# EAGLE schematic 1-Axis_Board_-_Camera_Gantry (EAGLE 6.4)
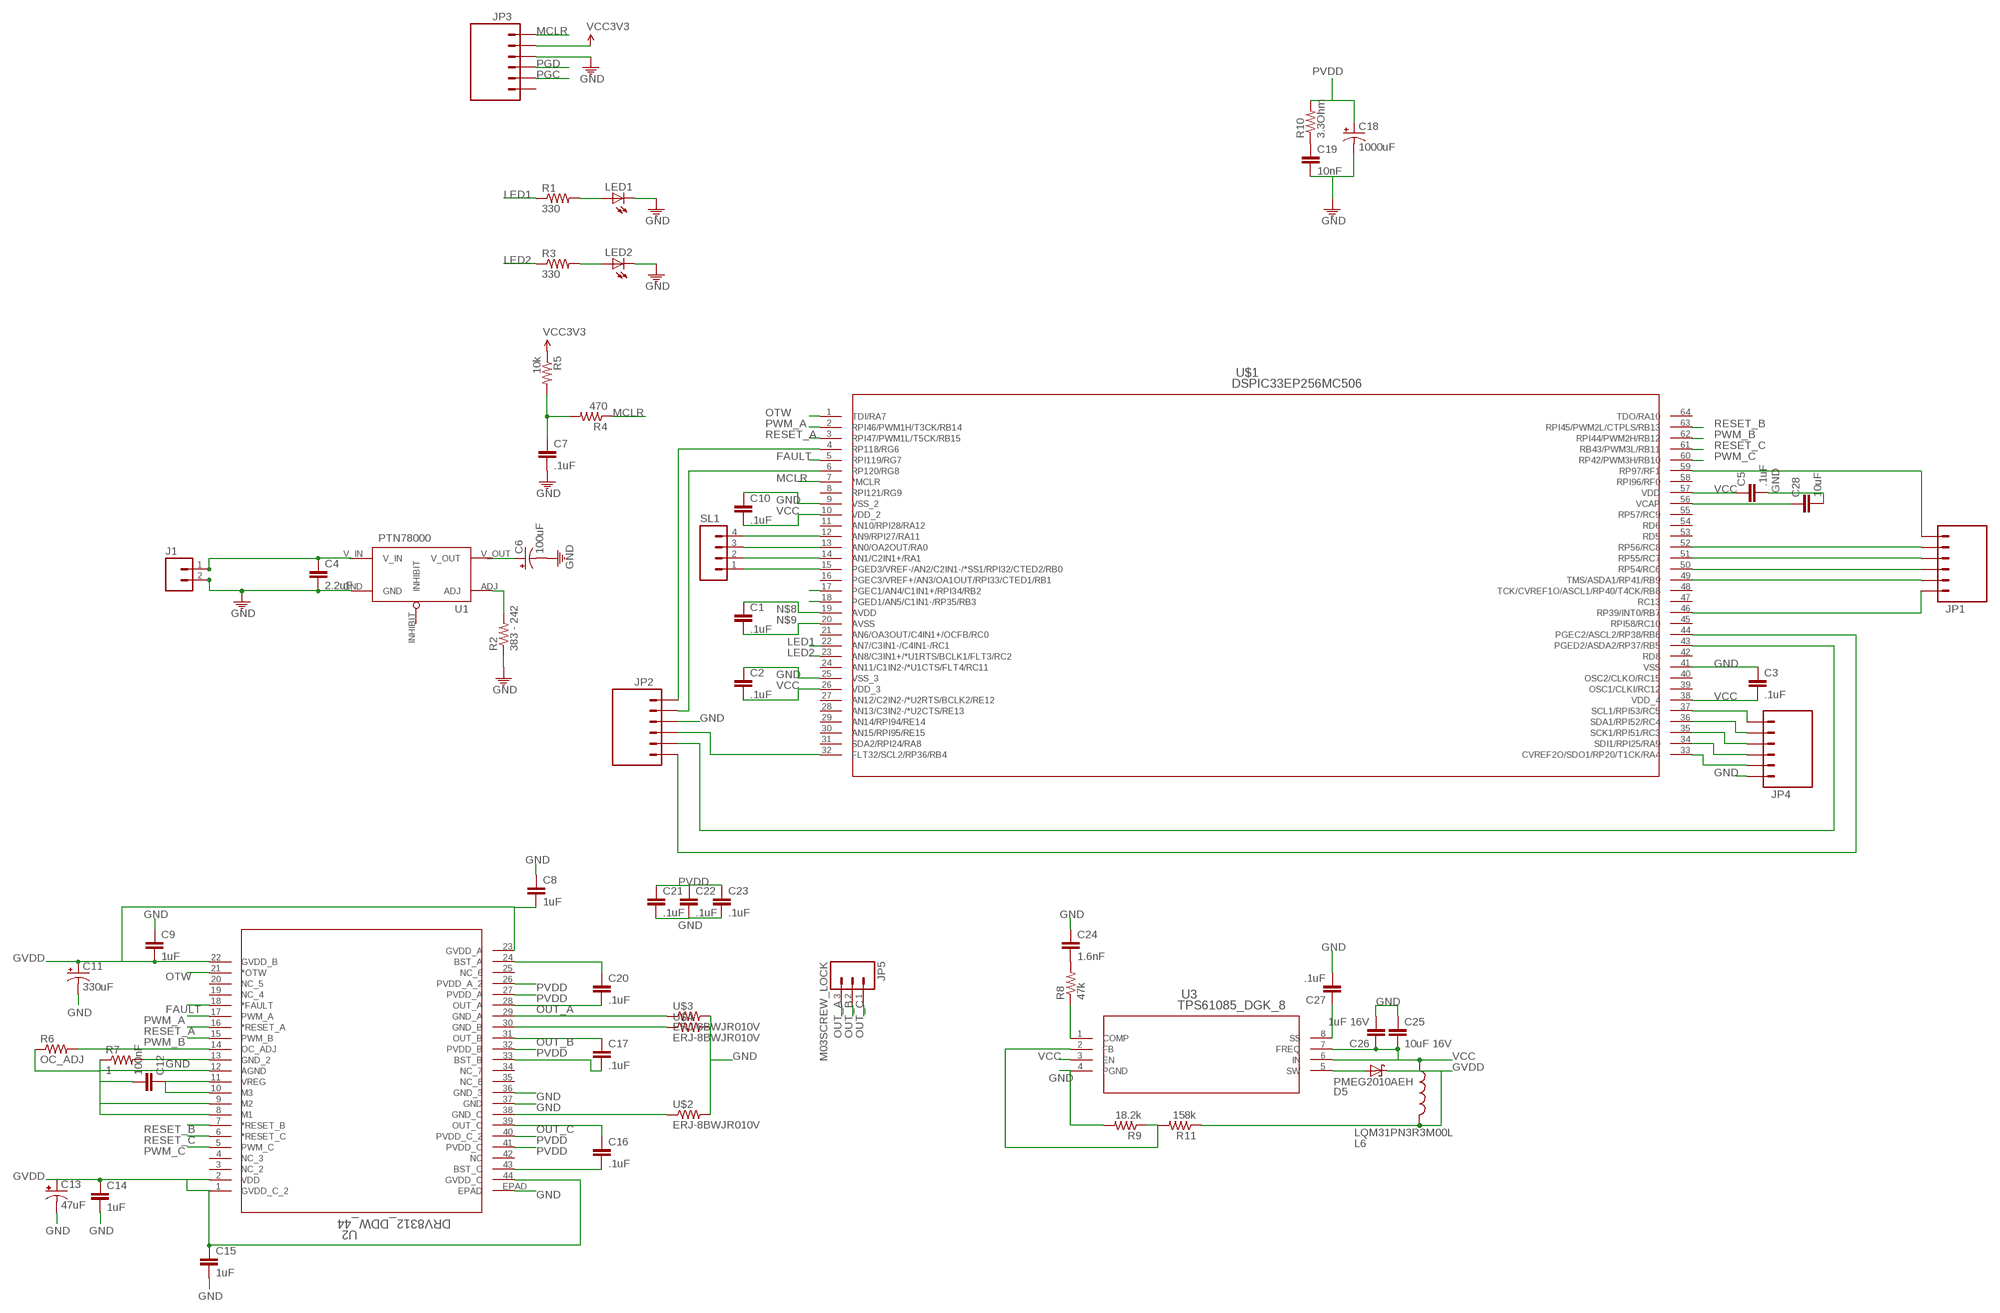
[diagram p0: schematic, sheet 1]

## Parts
C1  .1uF  CAP0805  [0805]
C2  .1uF  CAP0805  [0805]
C3  .1uF  CAP0805  [0805]
C4  2.2uF  CAP1206  [1206]
C5  .1uF  CAP0805  [0805]
C6  100uF  CAP_POLPTH1  [CPOL-RADIAL-100UF-25V]
C7  .1uF  CAP0805  [0805]
C8  1uF  CAP0805  [0805]
C9  1uF  CAP0805  [0805]
C10  .1uF  CAP0805  [0805]
C11  330uF  CAP_POLPTH4  [CPOL-RADIAL-1000UF-25V]
C12  100nF  CAP0805  [0805]
C13  47uF  CAP_POLPTH4  [CPOL-RADIAL-1000UF-25V]
C14  1uF  CAP0805  [0805]
C15  1uF  CAP0805  [0805]
C16  .1uF  CAP0805  [0805]
C17  .1uF  CAP0805  [0805]
C18  1000uF  CAP_POLPTH4  [CPOL-RADIAL-1000UF-25V]
C19  10nF  CAP0805  [0805]
C20  .1uF  CAP0805  [0805]
C21  .1uF  CAP0805  [0805]
C22  .1uF  CAP0805  [0805]
C23  .1uF  CAP0805  [0805]
C24  1.6nF  CAP0805  [0805]
C25  10uF 16V  CAP1206  [1206]
C26  1uF 16V  CAP0805  [0805]
C27  .1uF  CAP0805  [0805]
C28  10uF  CAP1206  [1206]
D5  PMEG2010AEH  [SOD-123]
J1  M023.5MM-NO_SILK  [SCREWTERMINAL-3.5MM-2-NS]
JP1  M06LOCK  [1X06_LOCK]
JP2  M06LOCK  [1X06_LOCK]
JP3  M06LOCK  [1X06_LOCK]
JP4  M06LOCK  [1X06_LOCK]
JP5  M03SCREW_LOCK  [SCREWTERMINAL-3.5MM-3_LOCK.007S]
L6  LQM31PN3R3M00L  [1206]
LED1  LED1206  [LED-1206]
LED2  LED1206  [LED-1206]
R1  330  RESISTOR0805-RES  [0805]
R2  383 - 242  RESISTOR0805-RES  [0805]
R3  330  RESISTOR0805-RES  [0805]
R4  470  RESISTOR0805-RES  [0805]
R5  10k  RESISTOR0805-RES  [0805]
R6  OC_ADJ  RESISTOR0805-RES  [0805]
R7  1  RESISTOR0805-RES  [0805]
R8  47k  RESISTOR0805-RES  [0805]
R9  18.2k  RESISTOR0805-RES  [0805]
R10  3.3Ohm  RESISTOR0805-RES  [0805]
R11  158k  RESISTOR0805-RES  [0805]
SL1  M04LOCK  [1X04_LOCK]
U1  PTN78000  PTN78000THROUGH-HOLE  [PTN78000]
U2  DRV8312_DDW_44  [DDW44_8P26X4P31]
U3  TPS61085_DGK_8  [DGK8]
U$1  DSPIC33EP256MC506  [QFP64-10X10MC]
U$2  ERJ-8BWJR010V  [1206]
U$3  ERJ-8BWJR010V  [1206]
U$4  ERJ-8BWJR010V  [1206]

## Nets
FAULT: U2.18(*FAULT) U$1.5(RPI119/RG7)
GND: C2.1 C3.1 C4.2 C5.2 C6.2(-) C7.2 C8.1 C9.1 C10.1 C11.2(-) C13.2(-) C14.2 C15.2 C18.2(-) C19.2 C21.2 C22.2 C23.2 C24.1 C25.1 C26.2 C27.2 C28.2 J1.2 JP2.3 JP3.3 JP4.1 LED1.C LED2.C R2.1 R7.2 R9.2 U1.GND U2.13(GND_2) U2.36(GND_3) U2.37(GND) U2.EPAD U3.4(PGND) U$1.9(VSS_2) U$1.25(VSS_3) U$1.41(VSS) U$2.2 U$3.2 U$4.2
GVDD: C8.2 C9.2 C11.1(+) C13.1(+) C14.1 C15.1 D5.C L6.2 R11.1 U2.1(GVDD_C_2) U2.2(VDD) U2.22(GVDD_B) U2.23(GVDD_A) U2.44(GVDD_C)
LED1: R1.1 U$1.22(AN7/C3IN1-/C4IN1-/RC1)
LED2: R3.1 U$1.23(AN8/C3IN1+/*U1RTS/BCLK1/FLT3/RC2)
MCLR: JP3.1 R4.1 U$1.7(*MCLR)
N$1: LED1.A R1.2
N$2: C7.1 R4.2 R5.2
N$3: LED2.A R3.2
N$4: U2.38(GND_C) U$2.1
N$5: U2.29(GND_A) U$3.1
N$6 [power]: R2.2 U1.ADJ
N$7: U2.30(GND_B) U$4.1
N$8: C1.1 U$1.19(AVDD)
N$9: C1.2 U$1.20(AVSS)
N$10: C27.1 U3.8(SS)
N$11: R8.1 U3.1(COMP)
N$12: C24.2 R8.2
N$13: C19.1 R10.1
N$14: C28.1 U$1.56(VCAP)
N$15: D5.A U3.5(SW)
N$16: R9.1 R11.2 U3.2(FB)
N$17: JP2.1 U$1.4(RP118/RG6)
N$19: JP2.4 U$1.32(FLT32/SCL2/RP36/RB4)
N$20: JP2.5 U$1.43(PGED2/ASDA2/RP37/RB5)
N$21: C16.2 U2.43(BST_C)
N$22: JP2.6 U$1.44(PGEC2/ASCL2/RP38/RB6)
N$23: JP1.1 U$1.46(RP39/INT0/RB7)
N$24: JP1.2 U$1.49(TMS/ASDA1/RP41/RB9)
N$25: JP1.3 U$1.50(RP54/RC6)
N$27: JP1.5 U$1.52(RP56/RC8)
N$28: JP1.6 U$1.59(RP97/RF1)
N$29: JP2.2 U$1.6(RP120/RG8)
N$30: C17.2 U2.33(BST_B)
N$32: JP1.4 U$1.51(RP55/RC7)
N$35: JP4.4 U$1.35(SCK1/RPI51/RC3)
N$36: JP4.5 U$1.36(SDA1/RPI52/RC4)
N$37: JP4.6 U$1.37(SCL1/RPI53/RC5)
N$38: JP4.3 U$1.34(SDI1/RPI25/RA9)
N$39: C20.1 U2.24(BST_A)
N$40: SL1.1 U$1.15(PGED3/VREF-/AN2/C2IN1-/*SS1/RPI32/CTED2/RB0)
N$41: SL1.2 U$1.14(AN1/C2IN1+/RA1)
N$42: SL1.3 U$1.13(AN0/OA2OUT/RA0)
N$43: SL1.4 U$1.12(AN9/RPI27/RA11)
N$44: JP4.2 U$1.33(CVREF2O/SDO1/RP20/T1CK/RA4)
N$45: C12.2 R6.1 R7.1 U2.8(M1) U2.9(M2) U2.12(AGND)
N$47: C12.1 U2.10(M3) U2.11(VREG)
OC_ADJ: R6.2 U2.14(OC_ADJ)
OTW: U2.21(*OTW) U$1.1(TDI/RA7)
OUT_A: C20.2 JP5.3 U2.28(OUT_A)
OUT_B: C17.1 JP5.2 U2.31(OUT_B)
OUT_C: C16.1 JP5.1 U2.39(OUT_C)
PGC: JP3.5 U$1.17(PGEC1/AN4/C1IN1+/RPI34/RB2)
PGD [small]: JP3.4 U$1.18(PGED1/AN5/C1IN1-/RP35/RB3)
PVDD [power]: C4.1 C18.1(+) C21.1 C22.1 C23.1 J1.1 R10.2 U1.V_IN U2.26(PVDD_A_2) U2.27(PVDD_A) U2.32(PVDD_B) U2.40(PVDD_C_2) U2.41(PVDD_C)
PWM_A: U2.17(PWM_A) U$1.2(RPI46/PWM1H/T3CK/RB14)
PWM_B: U2.15(PWM_B) U$1.62(RPI44/PWM2H/RB12)
PWM_C: U2.5(PWM_C) U$1.60(RP42/PWM3H/RB10)
RESET_A: U2.16(*RESET_A) U$1.3(RPI47/PWM1L/T5CK/RB15)
RESET_B: U2.7(*RESET_B) U$1.63(RPI45/PWM2L/CTPLS/RB13)
RESET_C: U2.6(*RESET_C) U$1.61(RB43/PWM3L/RB11)
VCC: C2.2 C3.2 C5.1 C6.1(+) C10.2 C25.2 C26.1 L6.1 U1.V_OUT U3.3(EN) U3.6(IN) U3.7(FREQ) U$1.10(VDD_2) U$1.26(VDD_3) U$1.38(VDD_4) U$1.57(VDD)
VCC3V3: JP3.2 R5.1
Unconnected: JP3.6 U1.INHIBIT U2.3(NC_2) U2.4(NC_3) U2.19(NC_4) U2.20(NC_5) U2.25(NC_6) U2.34(NC_7) U2.35(NC_8) U2.42(NC) U$1.8(RPI121/RG9) U$1.11(AN10/RPI28/RA12) U$1.16(PGEC3/VREF+/AN3/OA1OUT/RPI33/CTED1/RB1) U$1.21(AN6/OA3OUT/C4IN1+/OCFB/RC0) U$1.24(AN11/C1IN2-/*U1CTS/FLT4/RC11) U$1.27(AN12/C2IN2-/*U2RTS/BCLK2/RE12) U$1.28(AN13/C3IN2-/*U2CTS/RE13) U$1.29(AN14/RPI94/RE14) U$1.30(AN15/RPI95/RE15) U$1.31(SDA2/RPI24/RA8) U$1.39(OSC1/CLKI/RC12) U$1.40(OSC2/CLKO/RC15) U$1.42(RD8) U$1.45(RPI58/RC10) U$1.47(RC13) U$1.48(TCK/CVREF1O/ASCL1/RP40/T4CK/RB8) U$1.53(RD5) U$1.54(RD6) U$1.55(RP57/RC9) U$1.58(RPI96/RF0) U$1.64(TDO/RA10)

## Library data of the parts
C1-C3 C5 C7-C10 C12 C14-C17 C19-C28 = ASL:CAP: Capacitor Standard 0603 ceramic capacitor, and 0.1" leaded capacitor.
C4 = CMPE118lib:CAP: Capacitor Standard 0603 ceramic capacitor, and 0.1" leaded capacitor.
C6 C11 C13 C18 = ASL:CAP_POL: Capacitor Polarized These are standard SMD and PTH capacitors. Normally 10uF, 47uF, and 100uF in electrolytic and tantalum varieties. Always verify the external diameter of the through hole cap, it varies with capacity, voltage, and manufacturer. The EIA devices should be standard.
D5 = DRV83x2Support:PMEG2010AEH
J1 = ASL:M02: Header 2 Standard 2-pin 0.1" header. Use with straight break away headers (SKU : PRT-00116), right angle break away headers (PRT-00553), swiss pins (PRT-00743), machine pins (PRT-00117), and female headers (PRT-00115). Molex polarized connector foot print use with SKU : PRT-08233 with associated crimp pins and housings.
JP1 JP2 JP4 = ASL:M06: Header 6 Standard 6-pin 0.1" header. Use with straight break away headers (SKU : PRT-00116), right angle break away headers (PRT-00553), swiss pins (PRT-00743), machine pins (PRT-00117), and female headers (PRT-00115). Molex polarized connector foot print use with SKU : PRT-08094 with associated crimp pins and housings. NOTES ON THE VARIANTS LOCK and LOCK_LONGPADS... This footprint was designed to help hold the alignment of a through-hole component (i.e. 6-pin header) while soldering it into place. You may notice that each hole has been shifted either up or down by 0.005 of an inch from it's more standard position (which is a perfectly straight line). This slight alteration caused the pins (the squares in the middle) to touch the edges of the holes. Because they are alternating, it causes a "brace" to hold the component in place. 0.005 has proven to be the perfect amount of "off-center" position when using our standard breakaway headers. Although looks a little odd when you look at the bare footprint, once you have a header in there, the alteration is very hard to notice. Also, if you push a header all the way into place, it is covered up entirely on the bottom side. This idea of altering the position of holes to aid alignment will be further integrated into the Sparkfun Library for other footprints. It can help hold any component with 3 or more connection pins.
JP3 = CMPE118lib:M06: Header 6 Standard 6-pin 0.1" header. Use with straight break away headers (SKU : PRT-00116), right angle break away headers (PRT-00553), swiss pins (PRT-00743), machine pins (PRT-00117), and female headers (PRT-00115). Molex polarized connector foot print use with SKU : PRT-08094 with associated crimp pins and housings. NOTES ON THE VARIANTS LOCK and LOCK_LONGPADS... This footprint was designed to help hold the alignment of a through-hole component (i.e. 6-pin header) while soldering it into place. You may notice that each hole has been shifted either up or down by 0.005 of an inch from it's more standard position (which is a perfectly straight line). This slight alteration caused the pins (the squares in the middle) to touch the edges of the holes. Because they are alternating, it causes a "brace" to hold the component in place. 0.005 has proven to be the perfect amount of "off-center" position when using our standard breakaway headers. Although looks a little odd when you look at the bare footprint, once you have a header in there, the alteration is very hard to notice. Also, if you push a header all the way into place, it is covered up entirely on the bottom side. This idea of altering the position of holes to aid alignment will be further integrated into the Sparkfun Library for other footprints. It can help hold any component with 3 or more connection pins.
JP5 = ASL:M03: Header 3 Standard 3-pin 0.1" header. Use with straight break away headers (SKU : PRT-00116), right angle break away headers (PRT-00553), swiss pins (PRT-00743), machine pins (PRT-00117), and female headers (PRT-00115). Molex polarized connector foot print use with SKU : PRT-08232 with associated crimp pins and housings.
L6 = DRV83x2Support:LQM31PN3R3M00L
LED1 LED2 = CMPE118lib:LED: LEDs Standard schematic elements and footprints for 5mm, 3mm, 1206, and 0603 sized LEDs. 5mm - Spark Fun Electronics SKU : COM-00529 (and others); COLOR: red
R1-R5 = CMPE118lib:RESISTOR: Resistor Basic schematic elements and footprints for 0603, 1206, and PTH resistors.
R6-R11 = ASL:RESISTOR: Resistor Basic schematic elements and footprints for 0603, 1206, and PTH resistors.
SL1 = ASL:M04: AMP QUICK CONNECTOR
U1 = ASL:PTN78000: This is the PTN78000 part by Texas Instruments. It's a 1.5A adjustable switching regulator.
U2 = DRV83x2Support:DRV8312_DDW_44; DATASHEETURL: http://www.ti.com/lit/gpn/DRV8312; DESCRIPTION: 6.5A Three Phase Brushless DC Motor Driver with Inrush Protection (PWM Ctrl); FAMILY_NAME: 3-PHASE BRUSHLESS DRIVER; GENERIC_PART_NUMBER: DRV8312; INDUSTRY_STD_PKG_TYPE: HTSSOP; MANUFACTURER: Texas Instruments; MANUFACTURER_PART_NUMBER: drv8312_ddw_44; PACKAGE_DESIGNATOR: DDW; PIN_COUNT: 44; VENDOR: Texas Instruments
U3 = DRV83x2Support:TPS61085_DGK_8; DATASHEETURL: http://www.ti.com/lit/gpn/TPS61085; DESCRIPTION: 18.5V, 2A, 650kHz / 1.2MHz Step-Up DC-DC Converter w/ Forced PWM Mode; FAMILY_NAME: STEP-UP REGULATOR; GENERIC_PART_NUMBER: TPS61085; INDUSTRY_STD_PKG_TYPE: MSOP; MANUFACTURER: Texas Instruments; MANUFACTURER_PART_NUMBER: tps61085_dgk_8; PACKAGE_DESIGNATOR: DGK; PIN_COUNT: 8; VENDOR: Texas Instruments
U$1 = DRV83x2Support:DSPIC33EP256MC506
U$2-U$4 = DRV83x2Support:ERJ-8BWJR010V

## Net classes
0 default: width 0.406 mm
1 power: width 0.762 mm, clearance 0.254 mm to class 0, clearance 0.508 mm
2 small: width 0.254 mm, clearance 0.254 mm to class 1